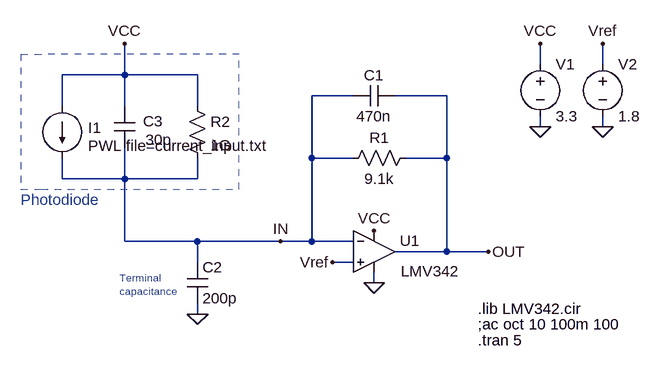
[diagram p0: schematic tia.asc]
tia.asc, the LTspice schematic file:
Version 4
SHEET 1 880 680
WIRE 432 -96 432 -128
WIRE 528 -96 528 -128
WIRE -208 -80 -208 -128
WIRE -208 -80 -304 -80
WIRE -96 -80 -208 -80
WIRE 144 -48 80 -48
WIRE 288 -48 208 -48
WIRE -304 -32 -304 -80
WIRE -208 -32 -208 -80
WIRE -96 -32 -96 -80
WIRE 432 0 432 -16
WIRE 528 0 528 -16
WIRE 80 48 80 -48
WIRE 144 48 80 48
WIRE 288 48 288 -48
WIRE 288 48 224 48
WIRE -304 80 -304 48
WIRE -208 80 -208 32
WIRE -208 80 -304 80
WIRE -96 80 -96 48
WIRE -96 80 -208 80
WIRE -208 176 -208 80
WIRE -96 176 -208 176
WIRE 32 176 -96 176
WIRE 80 176 80 48
WIRE 80 176 32 176
WIRE 144 176 80 176
WIRE 288 192 288 48
WIRE 288 192 208 192
WIRE 352 192 288 192
WIRE -96 208 -96 176
WIRE 144 208 112 208
WIRE 176 240 176 224
WIRE -96 288 -96 272
FLAG 432 0 0
FLAG 176 240 0
FLAG 528 0 0
FLAG 352 192 OUT
FLAG 32 176 IN
FLAG -96 288 0
FLAG 112 208 Vref
FLAG 528 -128 Vref
FLAG 432 -128 VCC
FLAG 176 160 VCC
FLAG -208 -128 VCC
SYMBOL voltage 432 -112 R0
WINDOW 123 0 0 Left 0
WINDOW 39 0 0 Left 0
SYMATTR InstName V1
SYMATTR Value 3.3
SYMBOL res 240 32 R90
WINDOW 0 0 56 VBottom 2
WINDOW 3 32 56 VTop 2
SYMATTR InstName R1
SYMATTR Value 9.1k
SYMBOL cap 208 -64 R90
WINDOW 0 0 32 VBottom 2
WINDOW 3 32 32 VTop 2
SYMATTR InstName C1
SYMATTR Value 470n
SYMBOL voltage 528 -112 R0
WINDOW 123 0 0 Left 0
WINDOW 39 0 0 Left 0
SYMATTR InstName V2
SYMATTR Value 1.8
SYMBOL current -304 -32 R0
WINDOW 39 0 0 Left 0
WINDOW 0 40 33 Left 2
WINDOW 3 40 61 Left 2
SYMATTR InstName I1
SYMATTR Value PWL file=current_input.txt
SYMATTR Value2 AC 100u
SYMBOL Opamps\\opamp2 176 128 R0
WINDOW 0 40 47 Left 2
WINDOW 3 41 94 Left 2
SYMATTR InstName U1
SYMATTR Value LMV342
SYMBOL cap -112 208 R0
SYMATTR InstName C2
SYMATTR Value 200p
SYMBOL cap -224 -32 R0
WINDOW 0 44 23 Left 2
WINDOW 3 48 52 Left 2
SYMATTR InstName C3
SYMATTR Value 30p
SYMBOL res -112 -48 R0
SYMATTR InstName R2
SYMATTR Value 1G
TEXT 336 304 Left 2 !;ac oct 10 100m 100
TEXT 336 280 Left 2 !.lib LMV342.cir
TEXT -216 232 Left 1 ;Terminal\ncapacitance
TEXT -368 112 Left 2 ;Photodiode
TEXT 336 328 Left 2 !.tran 5
LINE Normal -32 -112 -336 -112 2
LINE Normal -32 96 -32 -112 2
LINE Normal -336 96 -32 96 2
LINE Normal -368 -112 -368 96 2
LINE Normal -368 96 -336 96 2
LINE Normal -368 96 -368 96 2
LINE Normal -368 96 -368 96 2
LINE Normal -368 -112 -336 -112 2
LINE Normal -368 -112 -368 -112 2
LINE Normal -368 -112 -368 -112 2
LINE Normal -368 -112 -368 -112 2
LINE Normal -368 -112 -368 -112 2
LINE Normal -368 -112 -368 -112 2
LINE Normal -368 -112 -368 -112 2
LINE Normal -368 -112 -368 -112 2

The netlist it stands for:
* tia.asc
V1 VCC 0 3.3
R1 OUT IN 9.1k
C1 OUT IN 470n
V2 Vref 0 1.8
I1 VCC IN PWL file=current_input.txt AC 100u
XU1 Vref IN VCC 0 OUT LMV342  ; pins In+ In- V+ V- OUT
C2 IN 0 200p
C3 VCC IN 30p
R2 VCC IN 1G
;ac oct 10 100m 100
.lib LMV342.cir
* Terminal
* capacitance
* Photodiode
.tran 5
.backanno
.end